# EAGLE design Adafruit 2.8 TFT Breakout v2 (EAGLE 6.3)
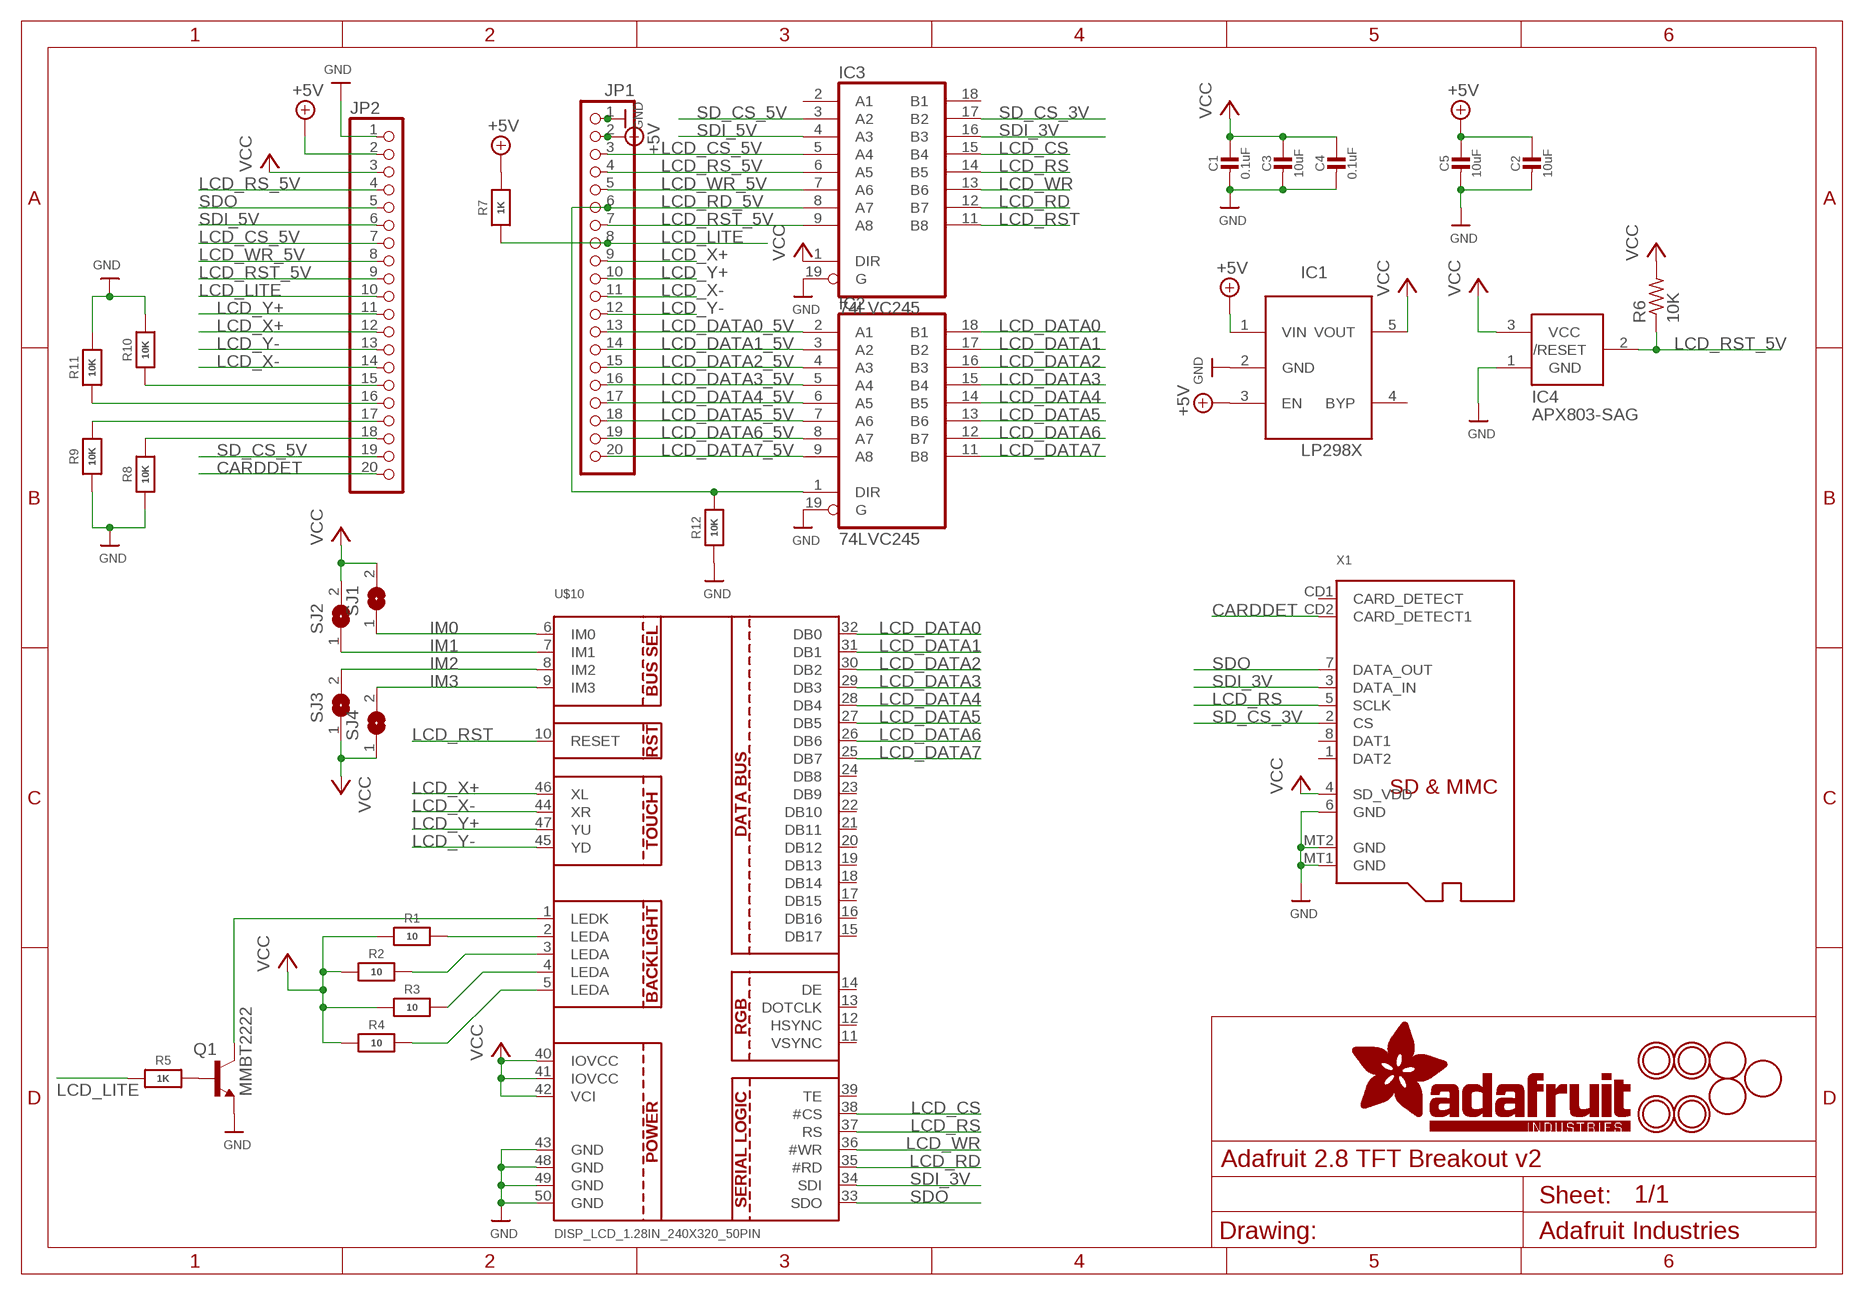
[diagram p0: schematic, sheet 1]

## Parts
C1  0.1uF  CAP_CERAMIC0805-NOOUTLINE  [0805-NO]
C2  10uF  CAP_CERAMIC0805-NOOUTLINE  [0805-NO]
C3  10uF  CAP_CERAMIC0805-NOOUTLINE  [0805-NO]
C4  0.1uF  CAP_CERAMIC0805-NOOUTLINE  [0805-NO]
C5  10uF  CAP_CERAMIC0805-NOOUTLINE  [0805-NO]
IC1  MIC5225-3.3  LP298XS  [SOT23-5L]
IC2  74LVC245  74ACT245DW  [SO20W]
IC3  74LVC245  74ACT245DW  [SO20W]
IC4  APX803-SAG  AXP083-SAG  [SOT23]
JP1  HEADER-1X20ROUND  [1X20_ROUND]
JP2  HEADER-1X20ROUND  [1X20_ROUND]
Q1  MMBT2222  MMBT2222ALT1-NPN-SOT23-BEC  [SOT23-BEC]
R1  10  RESISTOR0805_NOOUTLINE  [0805-NO]
R2  10  RESISTOR0805_NOOUTLINE  [0805-NO]
R3  10  RESISTOR0805_NOOUTLINE  [0805-NO]
R4  10  RESISTOR0805_NOOUTLINE  [0805-NO]
R5  1K  RESISTOR0805_NOOUTLINE  [0805-NO]
R6  10K  R-US_R0805  [R0805]
R7  1K  RESISTOR0805_NOOUTLINE  [0805-NO]
R8  10K  RESISTOR0805_NOOUTLINE  [0805-NO]
R9  10K  RESISTOR0805_NOOUTLINE  [0805-NO]
R10  10K  RESISTOR0805_NOOUTLINE  [0805-NO]
R11  10K  RESISTOR0805_NOOUTLINE  [0805-NO]
R12  10K  RESISTOR0805_NOOUTLINE  [0805-NO]
SJ1  SOLDERJUMPER  [SOLDERJUMPER_ARROW_NOPASTE]
SJ2  SOLDERJUMPER  [SOLDERJUMPER_ARROW_NOPASTE]
SJ3  SOLDERJUMPER  [SOLDERJUMPER_ARROW_NOPASTE]
SJ4  SOLDERJUMPER  [SOLDERJUMPER_ARROW_NOPASTE]
U$7  MOUNTINGHOLE3.0THIN  [MOUNTINGHOLE_3.0_PLATEDTHIN]
U$9  FIDUCIAL  [FIDUCIAL_1MM]
U$10  DISP_LCD_1.28IN_240X320_50PIN  [TFT_2.83IN_240X320_50PIN]
U$11  FIDUCIAL  [FIDUCIAL_1MM]
U$15  MOUNTINGHOLE3.0THIN  [MOUNTINGHOLE_3.0_PLATEDTHIN]
U$16  MOUNTINGHOLE3.0THIN  [MOUNTINGHOLE_3.0_PLATEDTHIN]
U$17  MOUNTINGHOLE3.0THIN  [MOUNTINGHOLE_3.0_PLATEDTHIN]
U$23  FIDUCIAL  [FIDUCIAL_1MM]
X1  MICROSD  [MICROSD]

## Nets
+5V: C2.1 C5.1 IC1.1(VIN) IC1.3(EN) JP1.2 JP2.2 R7.2
CARDDET: JP2.20 X1.CD2(CARD_DETECT1)
GND: C1.2 C2.2 C3.2 C4.2 C5.2 IC1.2(GND) IC2.19(G) IC3.19(G) IC4.1(GND) JP1.1 JP2.1 Q1.E R8.1 R9.1 R10.2 R11.2 R12.1 U$10.43(GND) U$10.48(GND) U$10.49(GND) U$10.50(GND) X1.6(GND) X1.MT1(GND) X1.MT2(GND)
IM0: JP2.18 R8.2 SJ1.1 U$10.6(IM0)
IM1: JP2.17 R9.2 SJ2.1 U$10.7(IM1)
IM2: JP2.16 R11.1 SJ3.2 U$10.8(IM2)
IM3: JP2.15 R10.1 SJ4.2 U$10.9(IM3)
LCD_CS: IC3.15(B4) U$10.38(#CS)
LCD_CS_5V: IC3.5(A4) JP1.3 JP2.7
LCD_DATA0: IC2.18(B1) U$10.32(DB0)
LCD_DATA0_5V: IC2.2(A1) JP1.13
LCD_DATA1: IC2.17(B2) U$10.31(DB1)
LCD_DATA1_5V: IC2.3(A2) JP1.14
LCD_DATA2: IC2.16(B3) U$10.30(DB2)
LCD_DATA2_5V: IC2.4(A3) JP1.15
LCD_DATA3: IC2.15(B4) U$10.29(DB3)
LCD_DATA3_5V: IC2.5(A4) JP1.16
LCD_DATA4: IC2.14(B5) U$10.28(DB4)
LCD_DATA4_5V: IC2.6(A5) JP1.17
LCD_DATA5: IC2.13(B6) U$10.27(DB5)
LCD_DATA5_5V: IC2.7(A6) JP1.18
LCD_DATA6: IC2.12(B7) U$10.26(DB6)
LCD_DATA6_5V: IC2.8(A7) JP1.19
LCD_DATA7: IC2.11(B8) U$10.25(DB7)
LCD_DATA7_5V: IC2.9(A8) JP1.20
LCD_LITE: JP1.8 JP2.10 R5.1 R7.1
LCD_RD: IC3.12(B7) U$10.35(#RD)
LCD_RD_5V: IC2.1(DIR) IC3.8(A7) JP1.6 R12.2
LCD_RS: IC3.14(B5) U$10.37(RS) X1.5(SCLK)
LCD_RS_5V: IC3.6(A5) JP1.4 JP2.4
LCD_RST: IC3.11(B8) U$10.10(RESET)
LCD_RST_5V: IC3.9(A8) IC4.2(/RESET) JP1.7 JP2.9 R6.1
LCD_WR: IC3.13(B6) U$10.36(#WR)
LCD_WR_5V: IC3.7(A6) JP1.5 JP2.8
LCD_X+: JP1.9 JP2.12 U$10.46(XL)
LCD_X-: JP1.11 JP2.14 U$10.44(XR)
LCD_Y+: JP1.10 JP2.11 U$10.47(YU)
LCD_Y-: JP1.12 JP2.13 U$10.45(YD)
N$1: R4.2 U$10.5(LEDA)
N$2: R1.2 U$10.2(LEDA)
N$3: R2.2 U$10.3(LEDA)
N$4: R3.2 U$10.4(LEDA)
N$5: Q1.C U$10.1(LEDK)
N$16: Q1.B R5.2
SD_CS_3V: IC3.17(B2) X1.2(CS)
SD_CS_5V: IC3.3(A2) JP2.19
SDI_3V: IC3.16(B3) U$10.34(SDI) X1.3(DATA_IN)
SDI_5V: IC3.4(A3) JP2.6
SDO: JP2.5 U$10.33(SDO) X1.7(DATA_OUT)
VCC: C1.1 C3.1 C4.1 IC1.5(VOUT) IC3.1(DIR) IC4.3(VCC) JP2.3 R1.1 R2.1 R3.1 R4.1 R6.2 SJ1.2 SJ2.2 SJ3.1 SJ4.1 U$10.40(IOVCC) U$10.41(IOVCC) U$10.42(VCI) X1.4(SD_VDD)
Unconnected: IC1.4(BYP) IC3.2(A1) IC3.18(B1) U$10.11(VSYNC) U$10.12(HSYNC) U$10.13(DOTCLK) U$10.14(DE) U$10.15(DB17) U$10.16(DB16) U$10.17(DB15) U$10.18(DB14) U$10.19(DB13) U$10.20(DB12) U$10.21(DB11) U$10.22(DB10) U$10.23(DB9) U$10.24(DB8) U$10.39(TE) X1.1(DAT2) X1.8(DAT1) X1.CD1(CARD_DETECT)

## Power pins joined to a net without a drawn wire
GND: IC2.10(GND) IC3.10(GND)
VCC: IC2.20(VCC) IC3.20(VCC)

## Library data of the parts
C1-C5 = microbuilder:CAP_CERAMIC: Ceramic Capacitors For new designs, use the packages preceded by an '_' character since they are more reliable: The following footprints should be used on most boards: _0402 - Standard footprint for regular board layouts _0603 - Standard footprint for regular board layouts _0805 - Standard footprint for regular board layouts _1206 - Standard footprint for regular board layouts For extremely tight-pitch boards where space is at a premium, the following 'micro-pitch' footprints can be used (smaller pads, no silkscreen outline, etc.): _0402MP - Micro-pitch footprint for very dense/compact boards _0603MP - Micro-pitch footprint for very dense/compact boards _0805MP - Micro-pitch footprint for very dense/compact boards _1206MP - Micro-pitch footprint for very dense/compact boards
IC1 = adafruit:LP298X
IC2 IC3 = 74xx-eu:74*245: Octal BUS TRANSCEIVER, 3-state
IC4 = adafruit:AXP083
JP1 JP2 = microbuilder:HEADER-1X20
Q1 = transistor-neu-to92:*-NPN-: NPN Transistror
R1-R5 R7-R12 = microbuilder:RESISTOR: Resistors For new designs, use the packages preceded by an '_' character since they are more reliable: The following footprints should be used on most boards: _0402 - Standard footprint for regular board layouts _0603 - Standard footprint for regular board layouts _0805 - Standard footprint for regular board layouts _1206 - Standard footprint for regular board layouts For extremely tight-pitch boards where space is at a premium, the following 'micro-pitch' footprints can be used (smaller pads, no silkscreen outline, etc.): _0402MP - Micro-pitch footprint for very dense/compact boards _0603MP - Micro-pitch footprint for very dense/compact boards _0805MP - Micro-pitch footprint for very dense/compact boards _1206MP - Micro-pitch footprint for very dense/compact boards
R6 = rcl:R-US_: RESISTOR, American symbol
SJ1-SJ4 = microbuilder:SOLDERJUMPER: SMD Solder JUMPER Solder the two pads together to create a connection, or remove the solder to break it. REFLOW - Use this footprint for solder paste and reflow ovens. WAVE - Use this footprint for hand-soldering (larger pads). CLOSED - Has a trace between the two pads to ensure it is closed by default. The trace needs to be cut to disable the jumper, and can be closed again by creating a solder bridge between the two pads.; BOM: EXCLUDE
U$7 U$15-U$17 = microbuilder:MOUNTINGHOLE: Mounting Hole For #2 screws (0.086"/2.18mm width, 0.094"/2.4mm hole) use 2.5mm; BOM: EXCLUDE
U$9 U$11 U$23 = adafruit:FIDUCIAL: For use by pick and place machines to calibrate the vision/machine, 1mm By microbuilder.eu
U$10 = microbuilder:DISP_LCD_1.28IN_240X320_50PIN
X1 = microbuilder:MICROSD: MicroSD/Transflash Card Holder with SPI pinout 3M: 2908-05WB-MG 4UConnector: 19656 Footprint courtesy: Adafruit Industries

## Board
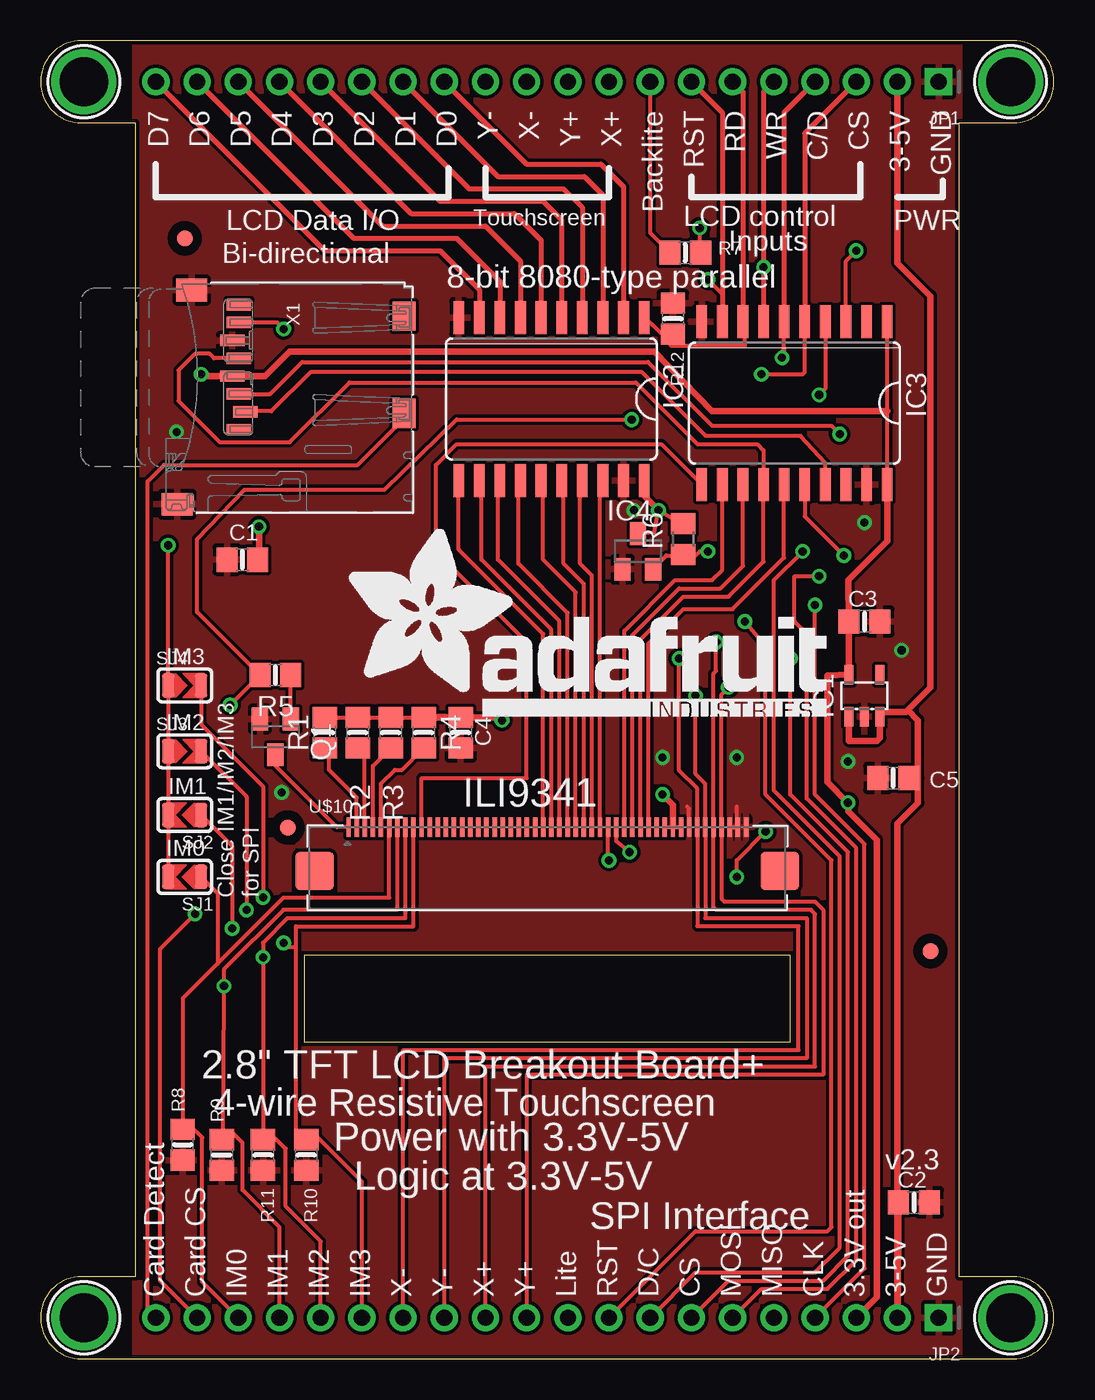
[diagram p1: board, top side]
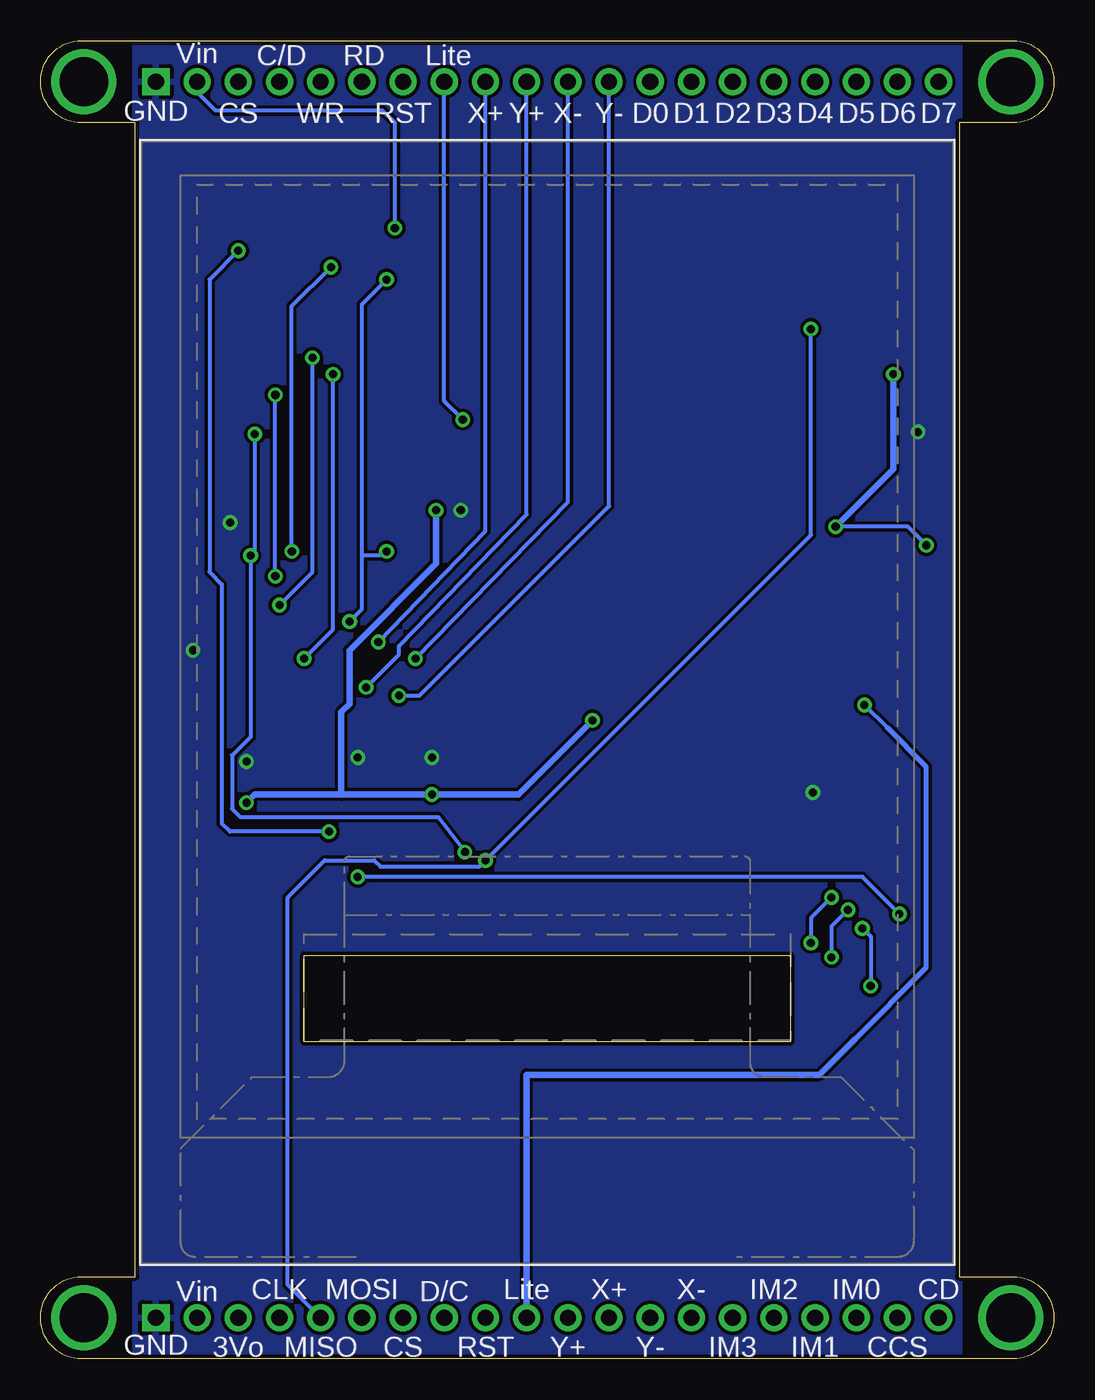
[diagram p2: board, bottom side, seen from below]

Size 62.48 x 81.28 mm. Coordinates in mm from the lower left corner, seen from the top.
Outline: 0,2.54 arc90 2.54,0 59.94,0 arc90 62.48,2.54 arc90 59.94,5.08 56.64,5.08 56.64,76.2 59.94,76.2 arc90 62.48,78.74 arc90 59.94,81.28 2.54,81.28 arc90 0,78.74 arc90 2.54,76.2 5.84,76.2 5.84,5.08 2.54,5.08 arc90 0,2.54
Outline: 16.26,24.89 16.26,19.56 46.23,19.56 46.23,24.89 16.26,24.89
Copper layers (1*16): Top 0.035mm / dielectric 1.5mm / Bottom 0.035mm
Design rules "adafruit": minimum track width 8mil, minimum drill 15.5mil, track to track 8mil, track to pad 8mil, pad to pad 8mil, via to via 8mil, smd to smd 8mil, copper to edge 10mil, drill to drill 8mil, minimum pad ring 10mil, minimum via ring 8mil, stop-mask expansion 4mil, vias tented up to drill 20mil, thermal gap 10mil

### Footprints (pad centres in the part's own frame; a part is rotated, then mirrored left to right if it is on the bottom)
0805-NO = smd 1.3 x 1.5: 1 -0.95,0; 2 0.95,0
SOT23-5L = smd 0.55 x 1.2: 1 -0.95,-1.3; 2 0,-1.3; 3 0.95,-1.3; 4 0.95,1.3; 5 -0.95,1.3
SO20W = smd 0.66 x 2.032: 1 -5.715,-5.029; 2 -4.445,-5.029; 3 -3.175,-5.029; 4 -1.905,-5.029; 5 -0.635,-5.029; 6 0.635,-5.029; 7 1.905,-5.029; 8 3.175,-5.029; 9 4.445,-5.029; 10 5.715,-5.029; 11 5.715,5.029; 12 4.445,5.029; 13 3.175,5.029; 14 1.905,5.029; 15 0.635,5.029; 16 -0.635,5.029; 17 -1.905,5.029; 18 -3.175,5.029; 19 -4.445,5.029; 20 -5.715,5.029
SOT23 = smd 1 x 1.4: 1 -0.95,-1.1; 2 0.95,-1.1; 3 0,1.1
1X20_ROUND = drill 1 pad 1.676 square: 1 -24.13,0 | drill 1 pad 1.676: 2 -21.59,0; 3 -19.05,0; 4 -16.51,0; 5 -13.97,0; 6 -11.43,0; 7 -8.89,0; 8 -6.35,0; 9 -3.81,0; 10 -1.27,0; 11 1.27,0; 12 3.81,0; 13 6.35,0; 14 8.89,0; 15 11.43,0; 16 13.97,0; 17 16.51,0; 18 19.05,0; 19 21.59,0; 20 24.13,0
SOT23-BEC = smd 1 x 1.4: B -0.95,-1.1; C 0,1.1; E 0.95,-1.1
R0805 = smd 1.3 x 1.5: 1 -0.95,0; 2 0.95,0
SOLDERJUMPER_ARROW_NOPASTE = smd 0.762 x 1.524: 1 -1.016,0; 2 1.016,0
MOUNTINGHOLE_3.0_PLATEDTHIN = drill 3 pad 3.6: P$1 0,0
FIDUCIAL_1MM = smd 1 x 1: 1 0,0
TFT_2.83IN_240X320_50PIN = smd 0.275 x 1.2 bottom: 1 12.25,-10.39; 2 11.75,-10.39; 3 11.25,-10.39; 4 10.75,-10.39; 5 10.25,-10.39; 6 9.75,-10.39; 7 9.25,-10.39; 8 8.75,-10.39; 9 8.25,-10.39; 10 7.75,-10.39; 11 7.25,-10.39; 12 6.75,-10.39; 13 6.25,-10.39; 14 5.75,-10.39; 15 5.25,-10.39; 16 4.75,-10.39; 17 4.25,-10.39; 18 3.75,-10.39; 19 3.25,-10.39; 20 2.75,-10.39; 21 2.25,-10.39; 22 1.75,-10.39; 23 1.25,-10.39; 24 0.75,-10.39; 25 0.25,-10.39; 26 -0.25,-10.39; 27 -0.75,-10.39; 28 -1.25,-10.39; 29 -1.75,-10.39; 30 -2.25,-10.39; 31 -2.75,-10.39; 32 -3.25,-10.39; 33 -3.75,-10.39; 34 -4.25,-10.39; 35 -4.75,-10.39; 36 -5.25,-10.39; 37 -5.75,-10.39; 38 -6.25,-10.39; 39 -6.75,-10.39; 40 -7.25,-10.39; 41 -7.75,-10.39; 42 -8.25,-10.39; 43 -8.75,-10.39; 44 -9.25,-10.39; 45 -9.75,-10.39; 46 -10.25,-10.39; 47 -10.75,-10.39; 48 -11.25,-10.39; 49 -11.75,-10.39; 50 -12.25,-10.39 | smd 2.4 x 2.4 bottom: PAD1 14.35,-13.09; PAD2 -14.35,-13.09
MICROSD = smd 0.7 x 1.5: 1 9,-10.64; 2 7.9,-10.24; 3 6.8,-10.64; 4 5.7,-11.04; 5 4.6,-10.64; 6 3.5,-11.04; 7 2.4,-10.64; 8 1.3,-10.64 | smd 1.8 x 1.4: CD1 2,-0.44; CD2 8,-0.44 | smd 1.4 x 1.9: MT1 0.4,-13.54; MT2 13.6,-14.44

### Placement (x,y rotation side)
C1  12.45,49.28 180 top
C2  53.85,9.65 0 top
C3  50.8,45.47 0 top
C4  25.91,38.61 270 top
C5  52.58,35.81 180 top
IC1  50.8,40.89 0 top
IC2  31.5,59.18 180 top
IC3  46.48,58.93 180 top
IC4  36.83,49.78 0 top
JP1  31.24,78.74 180 top
JP2  31.24,2.54 180 top
Q1  14.48,38.35 180 top
R1  17.53,38.61 270 top
R2  19.56,38.61 270 top
R3  21.59,38.61 270 top
R4  23.62,38.61 270 top
R5  14.48,42.16 0 top
R6  39.62,50.55 90 top
R7  39.75,68.2 0 top
R8  8.76,13.21 90 top
R9  11.18,12.57 90 top
R10  16.38,12.57 270 top
R11  13.72,12.57 270 top
R12  38.99,64.14 270 top
SJ1  8.89,29.72 180 top
SJ2  8.89,33.53 180 top
SJ3  8.89,37.47 0 top
SJ4  8.89,41.53 0 top
U$7  2.67,2.54 0 top
U$9  54.86,25.15 0 top
U$10  31.24,43.18 0 bottom
U$11  8.89,69.09 0 top
U$15  59.82,2.54 0 top
U$16  2.67,78.74 0 top
U$17  59.82,78.74 0 top
U$19  [ADAFRUIT_TEXT_30MM]  18.8,39.62 0 top
U$23  15.24,32.77 0 top
X1  22.86,66.29 270 top

### Tracks (layer width: path | path; a pad name or v marks a point on that pad's centre or on a via)
+5V  (via drill 0.5)
  Top 0.254: R7.2 40.64,68.26 v40.64,69.72
  Top 0.406: JP1.2 52.83,67.56 54.86,65.53 54.86,41.4 53.47,40.01 | 53.47,40.01 53.34,39.88 52.03,39.88 IC1.3 51.75,38.29 51.56,38.1 49.85,38.1 IC1.1 | 54.1,35.81 54.1,34.29 52.83,33.02 JP2.2 52.85,2.56 C2.1 | 54.1,35.81 54.1,39.37 53.47,40.01 | C5.1 54.1,35.81
  Bottom 0.254: v40.64,69.72 40.64,76.2 41.4,76.96 51.69,76.96 52.83,78.11 JP1.2
CARDDET
  Top 0.254: JP2.20 6.6,3.05 6.6,54.1 7.62,55.12 19.56,55.12 22.42,57.98 X1.CD2
GND  (via drill 0.5)
  Top 0.254: U$10.43 39.99,33.92 39.88,34.04 | U$10.48 42.93,32.79 42.93,34.04
  other vias: 36.58,52.32 50.8,51.56 38.35,37.08 42.93,37.08 49.78,36.83 53.09,43.69 14.86,34.92 8.38,57.15
  pour Top: 5.84,81.28 5.84,0 56.64,0 56.64,81.28
  pour Bottom: 5.84,81.03 5.84,-0.25 56.64,-0.25 56.64,81.03
IM0
  Top 0.254: 10.92,24.38 14.99,28.45 21.49,28.45 U$10.6 | JP2.18 9.97,4.77 9.97,13.66 9.27,14.35 8.96,14.22 R8.2 8.76,22.23 10.8,24.26 10.92,24.38 | SJ1.1 10.92,28.7 10.92,24.38
IM1  (via drill 0.5)
  Top 0.254: U$10.7 21.99,27.69 14.99,27.69 11.3,24 11.29,22.35 | JP2.17 14.73,8.13 12.45,10.41 12.45,13.34 11.75,14.03 11.23,14.03 | 11.29,22.35 11.23,14.03 | 11.23,14.03 R9.2 | SJ2.1 11.81,31.62 v11.81,26.54 | v11.3,22.99 11.29,22.97 11.29,22.35
  Bottom 0.254: v11.81,26.54 11.3,26.04 v11.3,22.99
IM2  (via drill 0.5)
  Top 0.254: U$10.8 22.49,27.18 15.24,27.18 13.72,25.65 13.72,24.89 v13.72,24.77 R11.1 13.66,13.59 14.48,13.59 15.11,12.95 15.11,9.4 17.27,7.24 JP2.16 | SJ3.2 12.7,34.67 v12.7,27.69
  Bottom 0.254: v12.7,27.69 13.72,26.67 v13.72,24.77
IM3  (via drill 0.5)
  Top 0.254: U$10.9 22.99,26.67 15.75,26.67 15.75,25.4 | JP2.15 19.81,10.92 17.02,13.72 16.58,13.72 R10.1 15.75,14.16 15.75,25.4 | 9.91,41.91 SJ4.2 9.91,39.12 13.72,35.31 v13.72,28.45 | v14.99,25.65 15.24,25.4 15.75,25.4
  Bottom 0.254: v13.72,28.45 14.99,27.18 v14.99,25.65
LCD_CS
  Top 0.254: U$10.38 37.49,44.1 39.62,46.23 42.67,46.23 45.85,49.4 IC3.15 45.97,53.77
LCD_CS_5V  (via drill 0.5)
  Top 0.254: JP2.7 42.42,4.83 48.26,4.83 49.78,6.35 49.78,31.24 46.23,34.8 v46.23,43.18 | v44.45,60.71 46.99,60.71 47.12,60.83 IC3.5
  Top 0.305: JP1.3 47.12,75.56 IC3.5
  Bottom 0.254: v46.23,43.18 44.45,44.96 v44.45,60.71
LCD_DATA0
  Top 0.254: U$10.32 34.49,53.97 IC2.18
LCD_DATA0_5V
  Top 0.305: JP1.13 29.97,73.66 34.54,73.66 35.94,72.26 IC2.2
LCD_DATA1
  Top 0.254: U$10.31 33.99,48.3 33.27,49.02 33.27,54.03 IC2.17
LCD_DATA1_5V
  Top 0.305: JP1.14 28.19,72.9 33.53,72.9 34.67,71.75 IC2.3
LCD_DATA2
  Top 0.254: U$10.30 33.49,47.79 32.26,49.02 32.26,54.03 IC2.16
LCD_DATA2_5V
  Top 0.305: JP1.15 26.42,72.14 32.26,72.14 33.4,70.99 IC2.4
LCD_DATA3
  Top 0.254: U$10.29 32.99,47.27 30.99,49.28 30.99,54.03 IC2.15
LCD_DATA3_5V
  Top 0.305: JP1.16 24.64,71.37 30.99,71.37 32.13,70.23 IC2.5
LCD_DATA4
  Top 0.254: U$10.28 32.49,45.99 29.46,49.02 29.46,54.03 IC2.14
LCD_DATA4_5V
  Top 0.305: JP1.17 22.86,70.61 29.21,70.61 30.86,68.96 IC2.6
LCD_DATA5
  Top 0.254: U$10.27 31.99,45.48 28.19,49.28 28.19,54.03 IC2.13
LCD_DATA5_5V
  Top 0.305: JP1.18 21.08,69.85 27.43,69.85 29.59,67.69 IC2.7
LCD_DATA6
  Top 0.254: U$10.26 31.49,44.96 27.18,49.28 27.18,54.03 IC2.12
LCD_DATA6_5V
  Top 0.305: JP1.19 19.3,69.09 25.65,69.09 28.32,66.42 IC2.8
LCD_DATA7
  Top 0.254: U$10.25 30.99,44.7 25.78,49.91 IC2.11
LCD_DATA7_5V
  Top 0.305: JP1.20 17.53,68.33 24.64,68.33 27.05,65.91 IC2.9
LCD_LITE  (via drill 0.5)
  Top 0.254: v36.45,57.91 25.65,57.91 21.21,53.59 12.57,53.59 9.65,50.55 9.65,46.04 R5.1 v11.68,40.32 | R7.1 37.59,69.41 JP1.8
  Bottom 0.254: v36.45,57.91 37.59,59.05 JP1.8 | v11.68,40.32 10.29,38.92
  Bottom 0.305: 12.32,19.69 7.87,24.13 7.87,36.51 10.29,38.92
  Bottom 0.406: JP2.10 32.51,17.53 14.48,17.53 12.32,19.69
LCD_RD
  Top 0.254: U$10.35 35.99,44.88 39.12,48.01 41.4,48.01 42.04,48.64 IC3.12 41.91,53.77
LCD_RD_5V
  Top 0.254: IC2.1 37.72,63.75 38.61,62.87 38.86,62.48 | 38.86,62.48 43.43,62.48 43.43,63.83 IC3.8 | R12.2 38.99,63.5 38.86,63.37 38.86,62.48
  Top 0.305: JP1.6 43.31,78.11 IC3.8
LCD_RS
  Top 0.254: U$10.37 36.99,44.36 39.62,46.99 42.42,46.99 44.58,49.15 IC3.14 | 44.45,53.77 IC3.14 | X1.5 10.7,61.69 10.41,61.98 9.53,61.98 8.51,60.96 8.51,59.05 11.05,56.52 15.37,56.52 19.05,60.2 36.7,60.2 40.51,56.39 44.2,56.39 44.58,56.01 IC3.14
LCD_RS_5V  (via drill 0.5)
  Top 0.254: v47.75,46.48 47.75,34.8 50.8,31.75 50.8,5.59 JP2.4 | v45.72,61.72 45.85,62.1 45.85,62.23 | 45.85,62.23 IC3.6 | 45.59,61.98 45.85,62.23
  Top 0.305: JP1.4 45.85,76.84 IC3.6
  Bottom 0.254: v47.75,46.48 45.72,48.51 v45.72,61.72
LCD_RST
  Top 0.254: U$10.10 23.49,35.81 29.97,35.81 29.97,44.2 24.38,49.78 24.38,55.12 25.65,56.39 38.28,56.39 IC3.11
LCD_RST_5V  (via drill 0.5)
  Top 0.254: JP2.9 40.39,7.87 48.51,7.87 48.77,8.13 48.77,30.73 44.7,34.8 44.7,43.94 v43.43,45.47 | v41.15,66.55 42.04,65.66 IC3.9 | IC4.2 38.59,49.53 40.39,49.53 | 40.39,49.53 40.2,49.85 R6.1 | 40.39,49.53 40.64,49.78 v41.15,49.78
  Top 0.305: JP1.7 42.04,76.84 IC3.9
  Bottom 0.254: v43.43,45.47 42.67,46.23 42.67,49.53 | 42.67,49.53 42.67,65.02 v41.15,66.55 | v41.15,49.78 41.4,49.53 42.67,49.53
LCD_WR
  Top 0.254: U$10.36 36.49,44.62 39.37,47.5 41.91,47.5 43.31,48.9 IC3.13 43.43,53.77
LCD_WR_5V  (via drill 0.5)
  Top 0.254: JP2.8 40.39,5.33 47.75,5.33 49.28,6.86 49.28,30.99 45.21,35.05 45.21,48.01 v46.99,49.78 | 44.7,63.83 IC3.7
  Top 0.305: JP1.5 44.58,78.11 v44.58,67.31 IC3.7
  Bottom 0.254: v46.99,49.78 46.99,64.9 v44.58,67.31
LCD_X+  (via drill 0.5)
  Top 0.254: v41.66,44.2 41.66,42.42 41.49,42.25 U$10.46 41.49,27.85 41.66,27.69 47.5,27.69 47.75,27.43 47.75,18.03 27.43,18.03 JP2.12
  Bottom 0.254: v41.66,44.2 35.05,51.05 JP1.9
LCD_X-  (via drill 0.5)
  Top 0.254: v39.37,43.18 39.37,36.28 40.49,35.16 U$10.44 40.49,26.67 46.74,26.67 46.74,19.05 22.35,19.05 JP2.14
  Bottom 0.254: v39.37,43.18 29.97,52.83 JP1.11
LCD_Y+  (via drill 0.5)
  Top 0.254: v42.42,41.4 41.99,40.98 U$10.47 41.99,28.37 42.16,28.19 47.75,28.19 48.26,27.69 48.26,17.53 29.97,17.53 JP2.11
  Bottom 0.254: v42.42,41.4 40.39,43.43 40.39,43.94 32.51,52.07 JP1.10
LCD_Y-  (via drill 0.5)
  Top 0.254: JP2.13 24.89,18.54 47.24,18.54 47.24,27.18 40.99,27.18 U$10.45 40.99,35.46 40.39,36.07 v40.39,40.89
  Bottom 0.254: v40.39,40.89 39.12,40.89 27.43,52.58 JP1.12
N$1
  Top 0.254: U$10.5 20.99,35.47 21.84,36.32 22.29,36.32 R4.2
N$2
  Top 0.254: U$10.2 19.49,34.61 17.78,36.32 17.78,37.4 R1.2
N$3
  Top 0.254: U$10.3 19.99,37.22 R2.2
N$4
  Top 0.254: U$10.4 20.49,36.56 R3.2
N$5
  Top 0.254: U$10.1 18.26,32.79 14.48,36.58 Q1.C
N$16
  Top 0.254: Q1.B R5.2
SD_CS_3V
  Top 0.254: IC3.17 48.39,55.25 46.86,56.9 41.02,56.9 37.08,60.83 16.64,60.83 14.22,58.42 12.65,58.42 X1.2
SD_CS_5V  (via drill 0.5)
  Top 0.254: IC3.3 49.66,67.69 v50.29,68.33 | JP2.19 7.37,4.83 7.37,25.27 v9.53,27.43 | v42.93,29.72 42.93,30.73 v44.7,32.51
  Bottom 0.254: v50.29,68.33 52.07,66.55 52.07,48.51 51.31,47.75 51.31,33.02 50.8,32.51 v44.7,32.51 | v42.93,29.72 11.81,29.72 v9.53,27.43
SDI_3V  (via drill 0.5)
  Top 0.254: IC3.16 47.12,51.94 v49.53,49.53 | v36.32,31.24 35.49,31.95 U$10.34 | X1.3 14.16,59.49 16.13,61.47 37.47,61.47 41.4,57.53 48.77,57.53 v49.28,57.02
  Bottom 0.254: v36.32,31.24 37.97,33.4 50.16,33.4 50.67,33.91 50.67,37.21 49.53,38.35 v49.53,49.53 49.28,49.78 v49.28,57.02
SDI_5V  (via drill 0.5)
  Top 0.254: JP2.6 44.45,4.32 48.51,4.32 50.29,6.1 50.29,31.5 47.24,34.54 47.24,44.7 46.48,45.47 46.48,48.26 v48.01,48.26 | IC3.4 48.39,59.82 v48.01,59.44
  Bottom 0.254: v48.01,48.26 v48.01,59.44
SDO  (via drill 0.5)
  Top 0.254: v35.05,30.73 34.99,30.79 U$10.33 | v14.99,63.5 14.59,63.89 X1.7
  Bottom 0.254: JP2.5 47.24,4.57 47.24,28.45 44.96,30.73 41.91,30.73 41.53,30.35 35.43,30.35 v35.05,30.73 14.99,50.8 v14.99,63.5
VCC  (via drill 0.5)
  Top 0.254: R1.1 R2.1 R3.1 R4.1 | IC3.20 52.2,58.42 IC3.1 | U$10.40 U$10.41 U$10.42 | R6.2 39.05,51.75 v38.1,52.32 37.85,50.97 IC4.3 | SJ2.2 SJ3.1 SJ4.1 v7.87,50.16 | 7.87,33.02 SJ2.2 | SJ2.2 SJ1.2
  Top 0.406: IC3.20 52.2,50.42 49.8,48.02 C3.1 IC1.5 48.51,42.13 48.51,35.56 v49.78,34.29 49.8,34.29 49.8,33.77 51.56,32 51.56,3.81 JP2.3 | R4.1 24.13,39.56 | 24.13,39.56 28.26,39.56 v28.45,39.37 | v38.35,34.8 38.99,34.16 U$10.41 | C4.1 24.18,39.61 24.13,39.56 | 52.2,58.42 41.4,58.42 37.85,62.1 15.37,62.1 13.86,60.59 X1.4 10.02,60.59 v9.91,60.71 | IC2.20 37.21,53.21 v38.1,52.32 | C1.1 13.46,49.29 v13.46,51.31
  Bottom 0.254: v7.87,50.16 9.02,51.31 v13.46,51.31
  Bottom 0.406: v28.45,39.37 33.02,34.8 v38.35,34.8 43.94,34.8 | 43.94,34.8 49.28,34.8 v49.78,34.29 | 43.94,34.8 43.94,39.88 43.43,40.39 43.43,43.69 38.1,49.02 v38.1,52.32 | v13.46,51.31 9.91,54.86 v9.91,60.71

### Text on the board
tPlace: D7 | D6 | D5 | D4 | D3 | D2 | D1 | D0 | Y- | X- | Y+ | X+ | Backlite | RST | RD | WR | C/D | CS | 3-5V | GND | LCD Data I/O | Touchscreen | LCD control | PWR | Inputs | Bi-directional | 8-bit 8080-type parallel | IM3 | IM2 | IM1 | ILI9341 | IM0 | Close IM1/IM2/IM3 / for SPI | 2.8" TFT LCD Breakout Board+ | 4-wire Resistive Touchscreen | Power with 3.3V-5V | v2.3 | Logic at 3.3V-5V | SPI Interface | Card Detect | Card CS | IM0 | IM1 | IM2 | IM3 | X- | Y- | X+ | Y+ | Lite | RST | D/C | CS | MOSI | MISO | CLK | 3.3V out | 3-5V | GND
bPlace: Lite | RD | C/D | Vin | D7 | D6 | D5 | D4 | D3 | D2 | D1 | D0 | Y- | X- | Y+ | X+ | RST | WR | CS | GND | CD | IM0 | IM2 | X- | X+ | Lite | D/C | MOSI | CLK | Vin | CCS | IM1 | IM3 | Y- | Y+ | RST | CS | MISO | 3Vo | GND